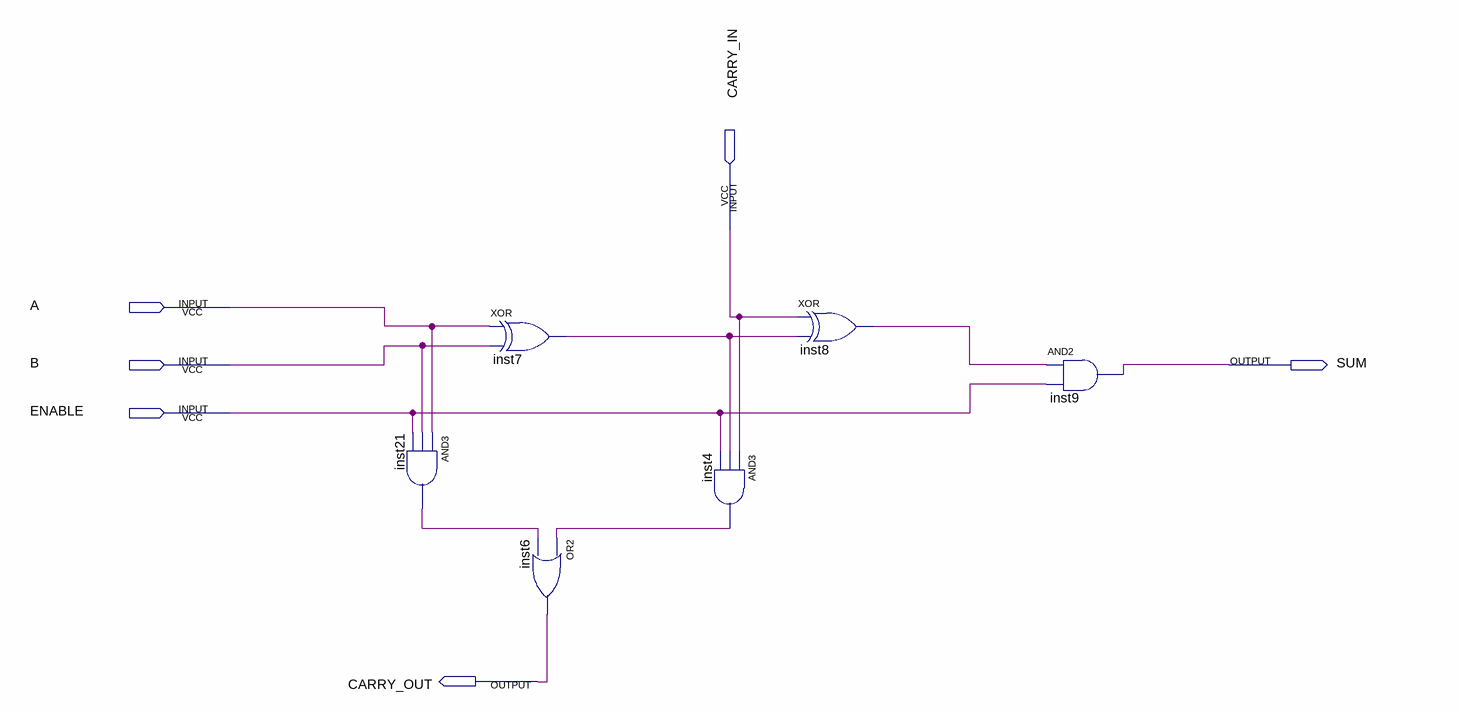
[diagram p0: schematic sheet]
// Quartus schematic FULL_ADDER_1BIT.bdf as structural Verilog: 6 symbols, 6 pins
module FULL_ADDER_1BIT (
  input  CARRY_IN,
  input  A,
  input  B,
  input  ENABLE,
  output SUM,
  output CARRY_OUT
);

  wire inst4_out, inst7_out, inst8_out, inst21_out;

  and inst21 (inst21_out, A, B, ENABLE);
  xor inst7 (inst7_out, A, B);
  or inst6 (CARRY_OUT, inst4_out, inst21_out);
  and inst4 (inst4_out, CARRY_IN, inst7_out, ENABLE);
  xor inst8 (inst8_out, CARRY_IN, inst7_out);
  and inst9 (SUM, inst8_out, ENABLE);
endmodule
